# Altium schematic sheet ARM JTAG Header (vertical).SchDoc
size A4
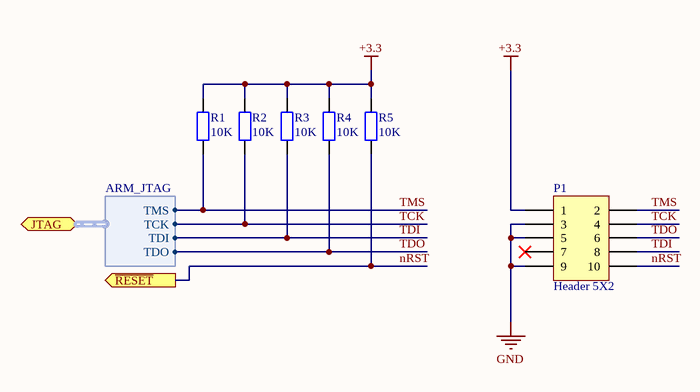
[diagram p0: ARM JTAG Header (vertical).SchDoc]

## Parts
P1  Header 5X2  [FTSH-105-01-L-DV]
R1  value 10K  [R0603]  (hidden comment: Res)
R2  value 10K  [R0603]  (hidden comment: Res)
R3  value 10K  [R0603]  (hidden comment: Res)
R4  value 10K  [R0603]  (hidden comment: Res)
R5  value 10K  [R0603]  (hidden comment: Res)

## Ports
JTAG (harness ARM_JTAG), ~{RESET} (out)

## Harnesses
ARM_JTAG: TDI, TMS, TCK, TDO

## Nets
+3.3: P1.1 R1.2 R2.2 R3.2 R4.2 R5.2
GND: P1.3 P1.5 P1.9
nRST: P1.10 R5.1 ; port ~{RESET}
TCK: P1.4 R2.1 ; port JTAG.TCK
TDI: P1.8 R3.1 ; port JTAG.TDI
TDO: P1.6 R4.1 ; port JTAG.TDO
TMS: P1.2 R1.1 ; port JTAG.TMS

Not connected (* = marked no-connect by the designer): P1 7*

## Library data of the parts
P1 = Header 5X2: Header, 5-Pin, Dual row; LatestRevisionDate: 17-Jul-2002; LatestRevisionNote: Re-released for DXP Platform.; Publisher: Altium Limited; farnell: 1667759
R1-R5 = Res2: Resistor; farnell: 1576297